# Altium schematic sheet PCB_IO.SchDoc
size A4; DocumentNumber: 7; SheetNumber: 7; SheetTotal: 8
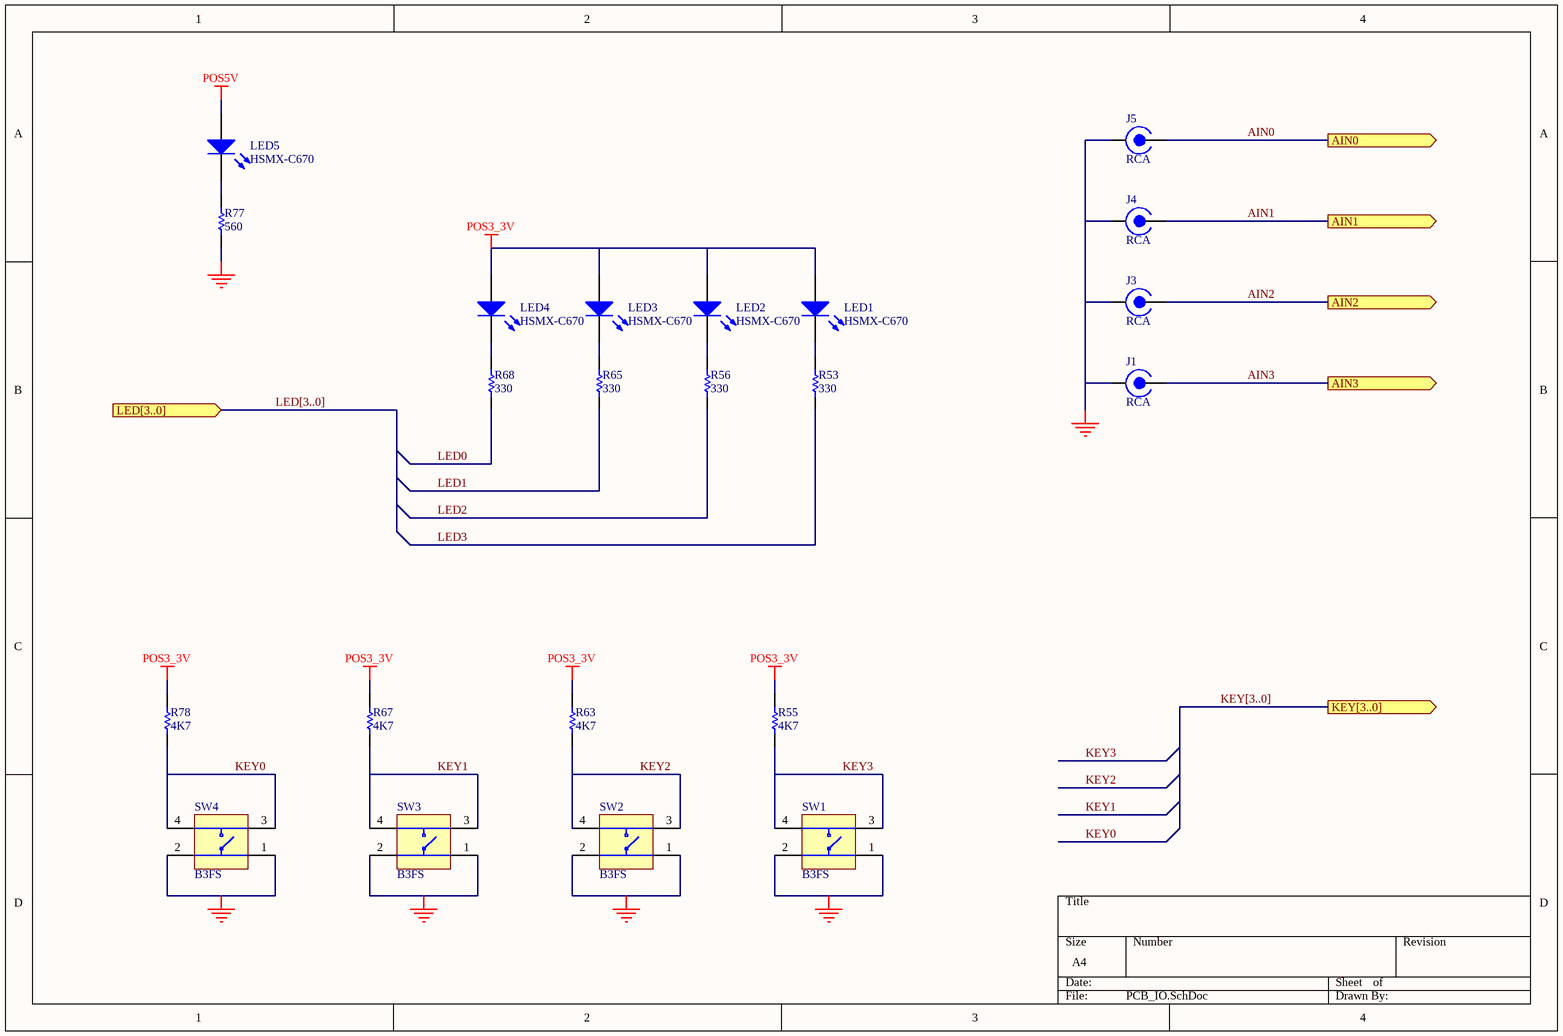
[diagram p0: PCB_IO.SchDoc]

## Parts
J1  RCA  [RCA_MR551L]
J3  RCA  [RCA_MR551L]
J4  RCA  [RCA_MR551L]
J5  RCA  [RCA_MR551L]
LED1  HSMX-C670  [SMD _LED]
LED2  HSMX-C670  [SMD _LED]
LED3  HSMX-C670  [SMD _LED]
LED4  HSMX-C670  [SMD _LED]
LED5  HSMX-C670  [SMD _LED]
R53  330  [CC2012-0805]
R55  4K7  [CC2012-0805]
R56  330  [CC2012-0805]
R63  4K7  [CC2012-0805]
R65  330  [CC2012-0805]
R67  4K7  [CC2012-0805]
R68  330  [CC2012-0805]
R77  560  [CC2012-0805]
R78  4K7  [CC2012-0805]
SW1  B3FS  [B3FS_SWITCH]
SW2  B3FS  [B3FS_SWITCH]
SW3  B3FS  [B3FS_SWITCH]
SW4  B3FS  [B3FS_SWITCH]

## Ports
AIN0 (out), AIN1 (out), AIN2 (out), AIN3 (out), KEY[3..0] (out), LED[3..0] (in)

## Nets
GND: J1.2 J3.2 J4.2 J5.2 R77.2 SW1.1 SW1.2 SW2.1 SW2.2 SW3.1 SW3.2 SW4.1 SW4.2
POS3_3V: LED1.1(A) LED2.1(A) LED3.1(A) LED4.1(A) R55.1 R63.1 R67.1 R78.1
POS5V: LED5.1(A)
AIN0: J5.1 ; port AIN0
AIN1: J4.1 ; port AIN1
AIN2: J3.1 ; port AIN2
AIN3: J1.1 ; port AIN3
KEY0: R78.2 SW4.3 SW4.4
KEY1: R67.2 SW3.3 SW3.4
KEY2: R63.2 SW2.3 SW2.4
KEY3: R55.2 SW1.3 SW1.4
LED0: R68.2
LED1: R65.2
LED2: R56.2
LED3: R53.2
NetLED1_2: LED1.2(K) R53.1
NetLED2_2: LED2.2(K) R56.1
NetLED3_2: LED3.2(K) R65.1
NetLED4_2: LED4.2(K) R68.1
NetLED5_2: LED5.2(K) R77.1

## Buses and harness runs
bus KEY[3..0] = port KEY[3..0]
bus LED[3..0] = port LED[3..0]

## Library data of the parts
J1 J3-J5 = RCA: RCA Socket
LED1-LED5 = HSMX-C670: Typical RED GaAs SMD LED Agilent make; Manufacturer: Generic Components; Class I: Optoelectronic; Fitted: True; Published: 8-Jun-2000; Revision: July-2002: Re-released for DXP Platform.; Publisher: Altium Limited; Class II: LED
R53 R55 R56 R63 R65 R67 R68 R77 R78 = RES: Resistor; Fitted: True
SW1-SW4 = B3FS: SPNA SMD Keyboard Switch; Fitted: True; Comment_1: B3FS